# Altium schematic sheet Touch_panel.SchDoc
size 381 x 279 mm
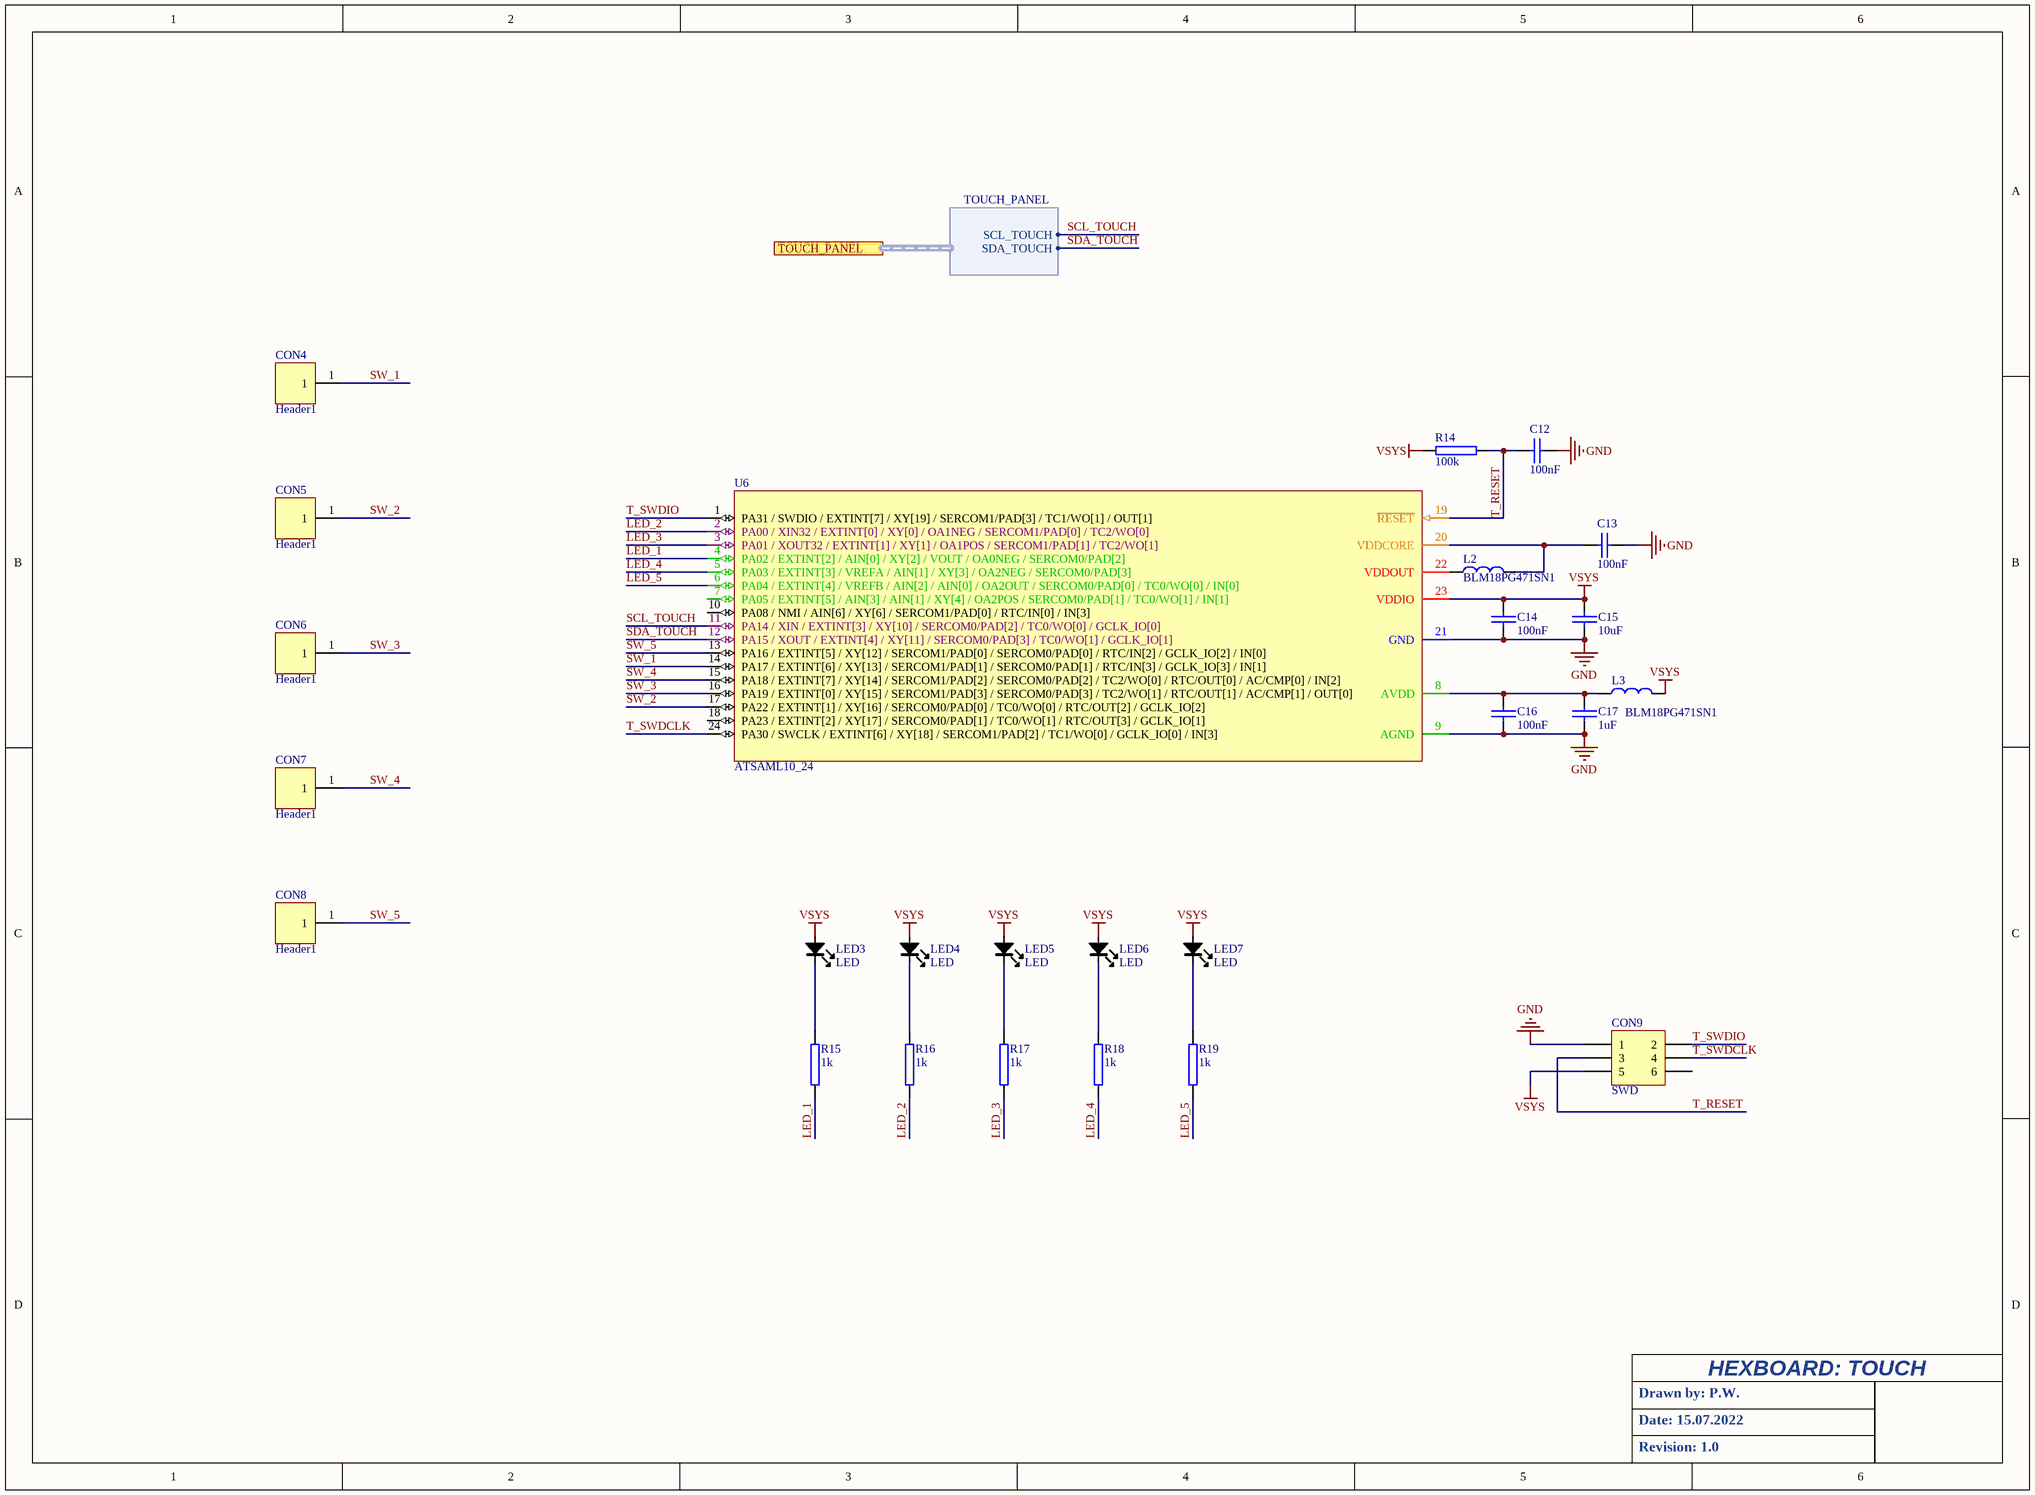
[diagram p0: Touch_panel.SchDoc]

## Parts
C12  100nF  [C0603L]
C13  100nF  [C0603L]
C14  100nF  [C0603L]
C15  10uF  [C0603L]
C16  100nF  [C0603L]
C17  1uF  [C0603L]
CON4  Header1  [P_CAP_13mm_B]
CON5  Header1  [P_CAP_13mm_B]
CON6  Header1  [P_CAP_13mm_B]
CON7  Header1  [P_CAP_13mm_B]
CON8  Header1  [P_CAP_13mm_B]
CON9  SWD  [HDR2x3_1mm27]
L2  BLM18PG471SN1  [L0805]
L3  BLM18PG471SN1  [L0805]
LED3  LED  [LED1206_BOTTOM_2_5]
LED4  LED  [LED1206_BOTTOM_2_5]
LED5  LED  [LED1206_BOTTOM_2_5]
LED6  LED  [LED1206_BOTTOM_2_5]
LED7  LED  [LED1206_BOTTOM_2_5]
R14  100k  [1608[0603]]
R15  1k  [1608[0603]]
R16  1k  [1608[0603]]
R17  1k  [1608[0603]]
R18  1k  [1608[0603]]
R19  1k  [1608[0603]]
U6  ATSAML10_24  [QFN24_4x4]

## Ports
TOUCH_PANEL (harness TOUCH_PANEL)

## Harnesses
TOUCH_PANEL: SDA_TOUCH, SCL_TOUCH

## Nets
GND: C12.2 C13.2 C14.2 C15.2 C16.2 C17.2 CON9.1 U6.9(AGND) U6.21(GND)
VSYS: C14.1 C15.1 CON9.5 L3.2 LED3.1(A) LED4.1(A) LED5.1(A) LED6.1(A) LED7.1(A) R14.1 U6.23(VDDIO)
LED_1: R15.1 U6.4(PA02_/_EXTINT[2]_/_AIN[0]_/_XY[2]_/_VOUT_/_OA0NEG_/_SERCOM0/PAD[2])
LED_2: R16.2 U6.2(PA00_/_XIN32_/_EXTINT[0]_/_XY[0]_/_OA1NEG_/_SERCOM1/PAD[0]_/_TC2/WO[0])
LED_3: R17.1 U6.3(PA01_/_XOUT32_/_EXTINT[1]_/_XY[1]_/_OA1POS_/_SERCOM1/PAD[1]_/_TC2/WO[1])
LED_4: R18.1 U6.5(PA03_/_EXTINT[3]_/_VREFA_/_AIN[1]_/_XY[3]_/_OA2NEG_/_SERCOM0/PAD[3])
LED_5: R19.2 U6.6(PA04_/_EXTINT[4]_/_VREFB_/_AIN[2]_/_AIN[0]_/_OA2OUT_/_SERCOM0/PAD[0]_/_TC0/WO[0]_/_IN[0])
SCL_TOUCH: U6.11(PA14_/_XIN_/_EXTINT[3]_/_XY[10]_/_SERCOM0/PAD[2]_/_TC0/WO[0]_/_GCLK_IO[0]) ; port TOUCH_PANEL.SCL_TOUCH
SDA_TOUCH: U6.12(PA15_/_XOUT_/_EXTINT[4]_/_XY[11]_/_SERCOM0/PAD[3]_/_TC0/WO[1]_/_GCLK_IO[1]) ; port TOUCH_PANEL.SDA_TOUCH
SW_1: CON4.1 U6.14(PA17_/_EXTINT[6]_/_XY[13]_/_SERCOM1/PAD[1]_/_SERCOM0/PAD[1]_/_RTC/IN[3]_/_GCLK_IO[3]_/_IN[1])
SW_2: CON5.1 U6.17(PA22_/_EXTINT[1]_/_XY[16]_/_SERCOM0/PAD[0]_/_TC0/WO[0]_/_RTC/OUT[2]_/_GCLK_IO[2])
SW_3: CON6.1 U6.16(PA19_/_EXTINT[0]_/_XY[15]_/_SERCOM1/PAD[3]_/_SERCOM0/PAD[3]_/_TC2/WO[1]_/_RTC/OUT[1]_/_AC/CMP[1]_/_OUT[0])
SW_4: CON7.1 U6.15(PA18_/_EXTINT[7]_/_XY[14]_/_SERCOM1/PAD[2]_/_SERCOM0/PAD[2]_/_TC2/WO[0]_/_RTC/OUT[0]_/_AC/CMP[0]_/_IN[2])
SW_5: CON8.1 U6.13(PA16_/_EXTINT[5]_/_XY[12]_/_SERCOM1/PAD[0]_/_SERCOM0/PAD[0]_/_RTC/IN[2]_/_GCLK_IO[2]_/_IN[0])
T_RESET: C12.1 CON9.3 R14.2 U6.19(~{RESET})
T_SWDCLK: CON9.4 U6.24(PA30_/_SWCLK_/_EXTINT[6]_/_XY[18]_/_SERCOM1/PAD[2]_/_TC1/WO[0]_/_GCLK_IO[0]_/_IN[3])
T_SWDIO: CON9.2 U6.1(PA31_/_SWDIO_/_EXTINT[7]_/_XY[19]_/_SERCOM1/PAD[3]_/_TC1/WO[1]_/_OUT[1])
NetC13_1: C13.1 L2.2 U6.20(VDDCORE)
NetC16_1: C16.1 C17.1 L3.1 U6.8(AVDD)
NetL2_1: L2.1 U6.22(VDDOUT)
NetLED3_2: LED3.2(K) R15.2
NetLED4_2: LED4.2(K) R16.1
NetLED5_2: LED5.2(K) R17.2
NetLED6_2: LED6.2(K) R18.2
NetLED7_2: LED7.2(K) R19.1

Not connected (* = marked no-connect by the designer): CON9 6; U6 7(PA05_/_EXTINT[5]_/_AIN[3]_/_AIN[1]_/_XY[4]_/_OA2POS_/_SERCOM0/PAD[1]_/_TC0/WO[1]_/_IN[1]) 10(PA08_/_NMI_/_AIN[6]_/_XY[6]_/_SERCOM1/PAD[0]_/_RTC/IN[0]_/_IN[3]) 18(PA23_/_EXTINT[2]_/_XY[17]_/_SERCOM0/PAD[1]_/_TC0/WO[1]_/_RTC/OUT[3]_/_GCLK_IO[1])

## Notes on the sheet
- HEXBOARD: TOUCH
- Drawn by: P.W.
- Date: 15.07.2022
- Revision: 1.0

## Library data of the parts
C12-C17 = CAP: Capacitor
CON9 = Header 3X2: Header, 3-Pin, Dual row; LatestRevisionDate: 17-Jul-2002; LatestRevisionNote: Re-released for DXP Platform.; Publisher: Altium Limited
L2 L3 = INDUCTOR
R14-R19 = RES
U6 = ATSAML10D15: Cortex M0+ microcontroller